# EAGLE design Encoder pHAT (EAGLE 9.6.2)
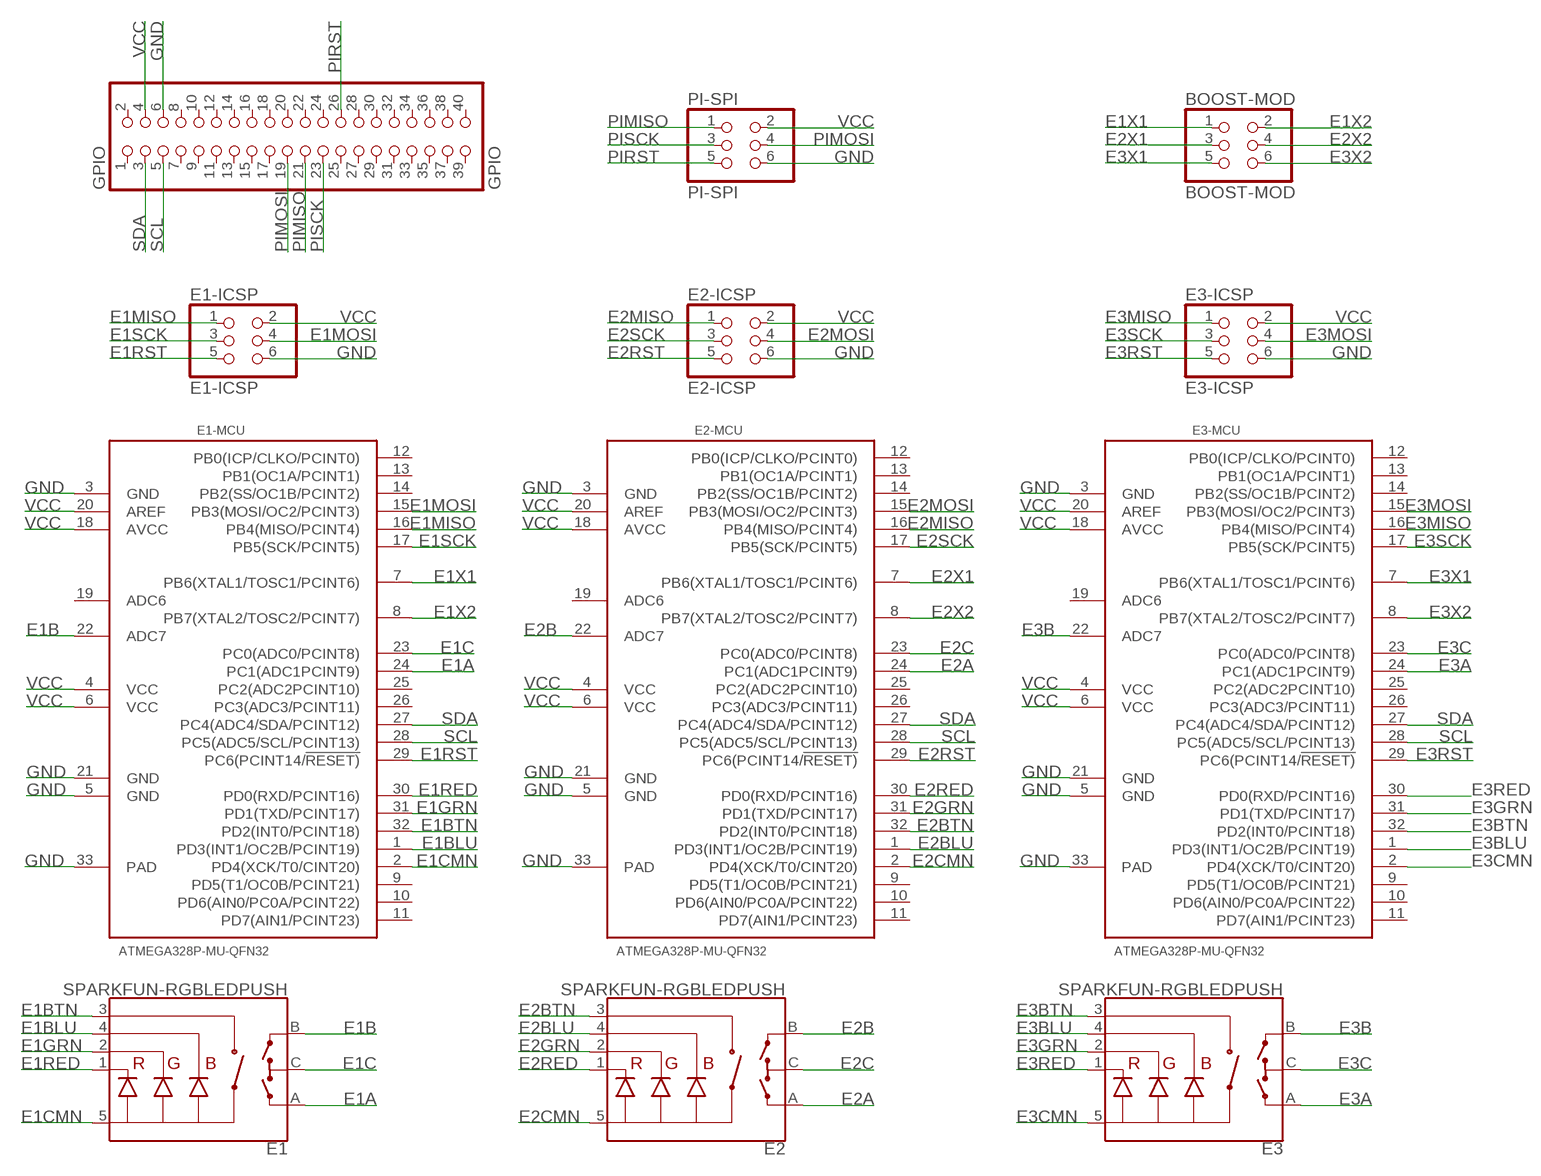
[diagram p0: schematic, sheet 1]

## Parts
BOOST-MOD  BOOST-MOD  PINHD-2X3  [2X03]
E1  SPARKFUN-RGBLEDPUSH  ENCODER-RGB-SWITCH  [ENCODER_LED_3]
E1-ICSP  E1-ICSP  PINHD-2X3  [2X03]
E1-MCU  ATMEGA328P-MU-QFN32  MCU-ATMEGA328P-MU(QFN32)  [QFN32G-0.5-5X5MM]
E2  SPARKFUN-RGBLEDPUSH  ENCODER-RGB-SWITCH  [ENCODER_LED_3]
E2-ICSP  E2-ICSP  PINHD-2X3  [2X03]
E2-MCU  ATMEGA328P-MU-QFN32  MCU-ATMEGA328P-MU(QFN32)  [QFN32G-0.5-5X5MM]
E3  SPARKFUN-RGBLEDPUSH  ENCODER-RGB-SWITCH  [ENCODER_LED_3]
E3-ICSP  E3-ICSP  PINHD-2X3  [2X03]
E3-MCU  ATMEGA328P-MU-QFN32  MCU-ATMEGA328P-MU(QFN32)  [QFN32G-0.5-5X5MM]
GPIO  GPIO  PINHD-2X20  [2X20]
PI-SPI  PI-SPI  PINHD-2X3  [2X03]

## Nets
E1A: E1-MCU.24(PC1(ADC1PCINT9)) E1.A
E1B: E1-MCU.22(ADC7) E1.B
E1BLU: E1-MCU.1(PD3(INT1/OC2B/PCINT19)) E1.4(-B)
E1BTN: E1-MCU.32(PD2(INT0/PCINT18)) E1.3(SW)
E1C: E1-MCU.23(PC0(ADC0/PCINT8)) E1.C
E1CMN: E1-MCU.2(PD4(XCK/T0/CINT20)) E1.5(+)
E1GRN: E1-MCU.31(PD1(TXD/PCINT17)) E1.2(-G)
E1MISO: E1-ICSP.1 E1-MCU.16(PB4(MISO/PCINT4))
E1MOSI: E1-ICSP.4 E1-MCU.15(PB3(MOSI/OC2/PCINT3))
E1RED: E1-MCU.30(PD0(RXD/PCINT16)) E1.1(-R)
E1RST: E1-ICSP.5 E1-MCU.29(PC6(PCINT14/!RESET))
E1SCK: E1-ICSP.3 E1-MCU.17(PB5(SCK/PCINT5))
E1X1: BOOST-MOD.1 E1-MCU.7(PB6(XTAL1/TOSC1/PCINT6))
E1X2: BOOST-MOD.2 E1-MCU.8(PB7(XTAL2/TOSC2/PCINT7))
E2A: E2-MCU.24(PC1(ADC1PCINT9)) E2.A
E2B: E2-MCU.22(ADC7) E2.B
E2BLU: E2-MCU.1(PD3(INT1/OC2B/PCINT19)) E2.4(-B)
E2BTN: E2-MCU.32(PD2(INT0/PCINT18)) E2.3(SW)
E2C: E2-MCU.23(PC0(ADC0/PCINT8)) E2.C
E2CMN: E2-MCU.2(PD4(XCK/T0/CINT20)) E2.5(+)
E2GRN: E2-MCU.31(PD1(TXD/PCINT17)) E2.2(-G)
E2MISO: E2-ICSP.1 E2-MCU.16(PB4(MISO/PCINT4))
E2MOSI: E2-ICSP.4 E2-MCU.15(PB3(MOSI/OC2/PCINT3))
E2RED: E2-MCU.30(PD0(RXD/PCINT16)) E2.1(-R)
E2RST: E2-ICSP.5 E2-MCU.29(PC6(PCINT14/!RESET))
E2SCK: E2-ICSP.3 E2-MCU.17(PB5(SCK/PCINT5))
E2X1: BOOST-MOD.3 E2-MCU.7(PB6(XTAL1/TOSC1/PCINT6))
E2X2: BOOST-MOD.4 E2-MCU.8(PB7(XTAL2/TOSC2/PCINT7))
E3A: E3-MCU.24(PC1(ADC1PCINT9)) E3.A
E3B: E3-MCU.22(ADC7) E3.B
E3BLU: E3-MCU.1(PD3(INT1/OC2B/PCINT19)) E3.4(-B)
E3BTN: E3-MCU.32(PD2(INT0/PCINT18)) E3.3(SW)
E3C: E3-MCU.23(PC0(ADC0/PCINT8)) E3.C
E3CMN: E3-MCU.2(PD4(XCK/T0/CINT20)) E3.5(+)
E3GRN: E3-MCU.31(PD1(TXD/PCINT17)) E3.2(-G)
E3MISO: E3-ICSP.1 E3-MCU.16(PB4(MISO/PCINT4))
E3MOSI: E3-ICSP.4 E3-MCU.15(PB3(MOSI/OC2/PCINT3))
E3RED: E3-MCU.30(PD0(RXD/PCINT16)) E3.1(-R)
E3RST: E3-ICSP.5 E3-MCU.29(PC6(PCINT14/!RESET))
E3SCK: E3-ICSP.3 E3-MCU.17(PB5(SCK/PCINT5))
E3X1: BOOST-MOD.5 E3-MCU.7(PB6(XTAL1/TOSC1/PCINT6))
E3X2: BOOST-MOD.6 E3-MCU.8(PB7(XTAL2/TOSC2/PCINT7))
GND: E1-ICSP.6 E1-MCU.3(GND) E1-MCU.5(GND) E1-MCU.21(GND) E1-MCU.33(PAD) E2-ICSP.6 E2-MCU.3(GND) E2-MCU.5(GND) E2-MCU.21(GND) E2-MCU.33(PAD) E3-ICSP.6 E3-MCU.3(GND) E3-MCU.5(GND) E3-MCU.21(GND) E3-MCU.33(PAD) GPIO.6 PI-SPI.6
PIMISO: GPIO.21 PI-SPI.1
PIMOSI: GPIO.19 PI-SPI.4
PIRST: GPIO.26 PI-SPI.5
PISCK: GPIO.23 PI-SPI.3
SCL: E1-MCU.28(PC5(ADC5/SCL/PCINT13)) E2-MCU.28(PC5(ADC5/SCL/PCINT13)) E3-MCU.28(PC5(ADC5/SCL/PCINT13)) GPIO.5
SDA: E1-MCU.27(PC4(ADC4/SDA/PCINT12)) E2-MCU.27(PC4(ADC4/SDA/PCINT12)) E3-MCU.27(PC4(ADC4/SDA/PCINT12)) GPIO.3
VCC: E1-ICSP.2 E1-MCU.4(VCC) E1-MCU.6(VCC) E1-MCU.18(AVCC) E1-MCU.20(AREF) E2-ICSP.2 E2-MCU.4(VCC) E2-MCU.6(VCC) E2-MCU.18(AVCC) E2-MCU.20(AREF) E3-ICSP.2 E3-MCU.4(VCC) E3-MCU.6(VCC) E3-MCU.18(AVCC) E3-MCU.20(AREF) GPIO.4 PI-SPI.2
Unconnected: E1-MCU.9(PD5(T1/OC0B/PCINT21)) E1-MCU.10(PD6(AIN0/PC0A/PCINT22)) E1-MCU.11(PD7(AIN1/PCINT23)) E1-MCU.12(PB0(ICP/CLKO/PCINT0)) E1-MCU.13(PB1(OC1A/PCINT1)) E1-MCU.14(PB2(SS/OC1B/PCINT2)) E1-MCU.19(ADC6) E1-MCU.25(PC2(ADC2PCINT10)) E1-MCU.26(PC3(ADC3/PCINT11)) E2-MCU.9(PD5(T1/OC0B/PCINT21)) E2-MCU.10(PD6(AIN0/PC0A/PCINT22)) E2-MCU.11(PD7(AIN1/PCINT23)) E2-MCU.12(PB0(ICP/CLKO/PCINT0)) E2-MCU.13(PB1(OC1A/PCINT1)) E2-MCU.14(PB2(SS/OC1B/PCINT2)) E2-MCU.19(ADC6) E2-MCU.25(PC2(ADC2PCINT10)) E2-MCU.26(PC3(ADC3/PCINT11)) E3-MCU.9(PD5(T1/OC0B/PCINT21)) E3-MCU.10(PD6(AIN0/PC0A/PCINT22)) E3-MCU.11(PD7(AIN1/PCINT23)) E3-MCU.12(PB0(ICP/CLKO/PCINT0)) E3-MCU.13(PB1(OC1A/PCINT1)) E3-MCU.14(PB2(SS/OC1B/PCINT2)) E3-MCU.19(ADC6) E3-MCU.25(PC2(ADC2PCINT10)) E3-MCU.26(PC3(ADC3/PCINT11)) GPIO.1 GPIO.2 GPIO.7 GPIO.8 GPIO.9 GPIO.10 GPIO.11 GPIO.12 GPIO.13 GPIO.14 GPIO.15 GPIO.16 GPIO.17 GPIO.18 GPIO.20 GPIO.22 GPIO.24 GPIO.25 GPIO.27 GPIO.28 GPIO.29 GPIO.30 GPIO.31 GPIO.32 GPIO.33 GPIO.34 GPIO.35 GPIO.36 GPIO.37 GPIO.38 GPIO.39 GPIO.40

## Library data of the parts
BOOST-MOD E1-ICSP E2-ICSP E3-ICSP PI-SPI = pinhead:PINHD-2X3: PIN HEADER
E1-E3 = SparkFun-Switches:ENCODER-RGB-SWITCH: Illuminated Rotary Encoder w/ RGB LED and select switch Encoders rotate similarly to potentiometers, but they’re different from potentiometers in that an encoder has full rotation without limits. They output gray code so that you can tell how much and in which direction the encoder has been turned. This encoder includes an RGB LED and a push-down select switch. Part #: Top Up EC12PLRGBSDVBF-D <http://top-up.so-buy.com/front/bin/ptdetail.phtml?Part=EC12PLRGBSDVBF-D> SparkFun Products Rotary Encoder - Illuminated (RGB) <https://www.sparkfun.com/products/10982> (COM-10982); PROD_ID: RES-10859; SF_SKU: COM-10982
E1-MCU E2-MCU E3-MCU = OPL_IC:MCU-ATMEGA328P-MU(QFN32): 310010005; MPN: ATMEGA328P-MU
GPIO = pinhead:PINHD-2X20: PIN HEADER

## Board
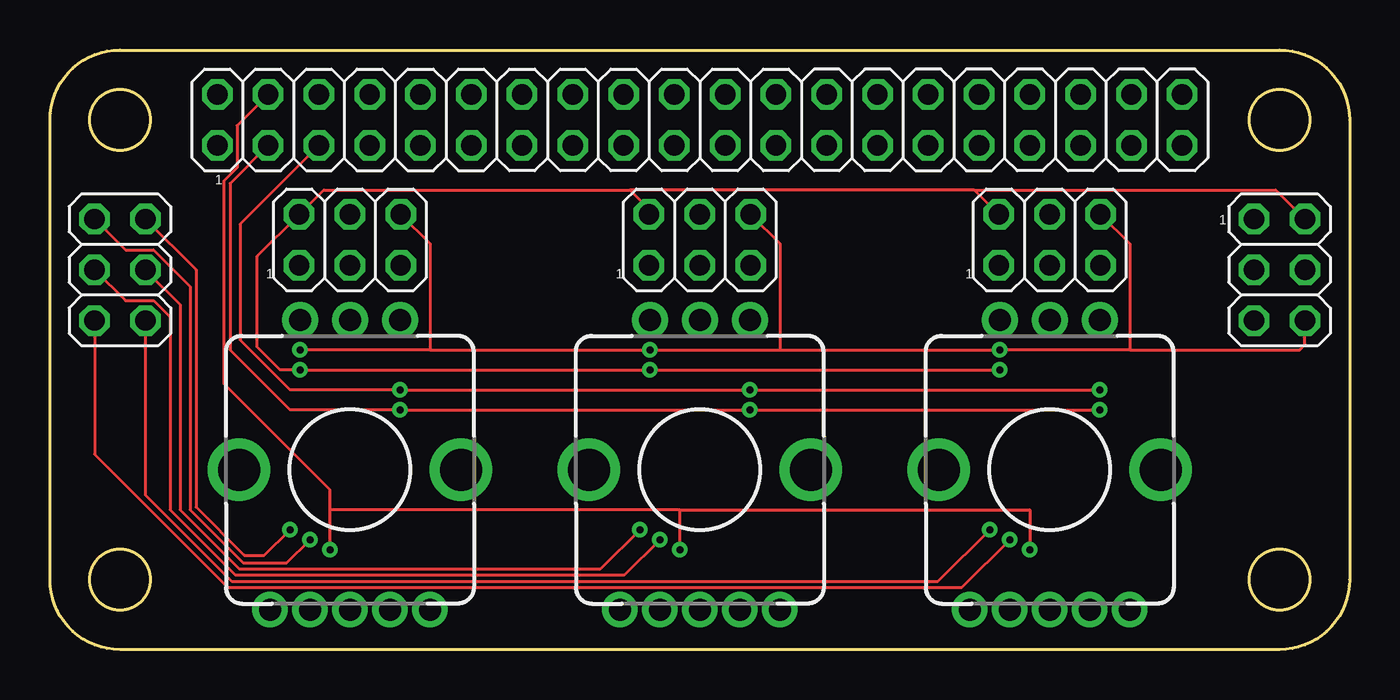
[diagram p1: board, top side]
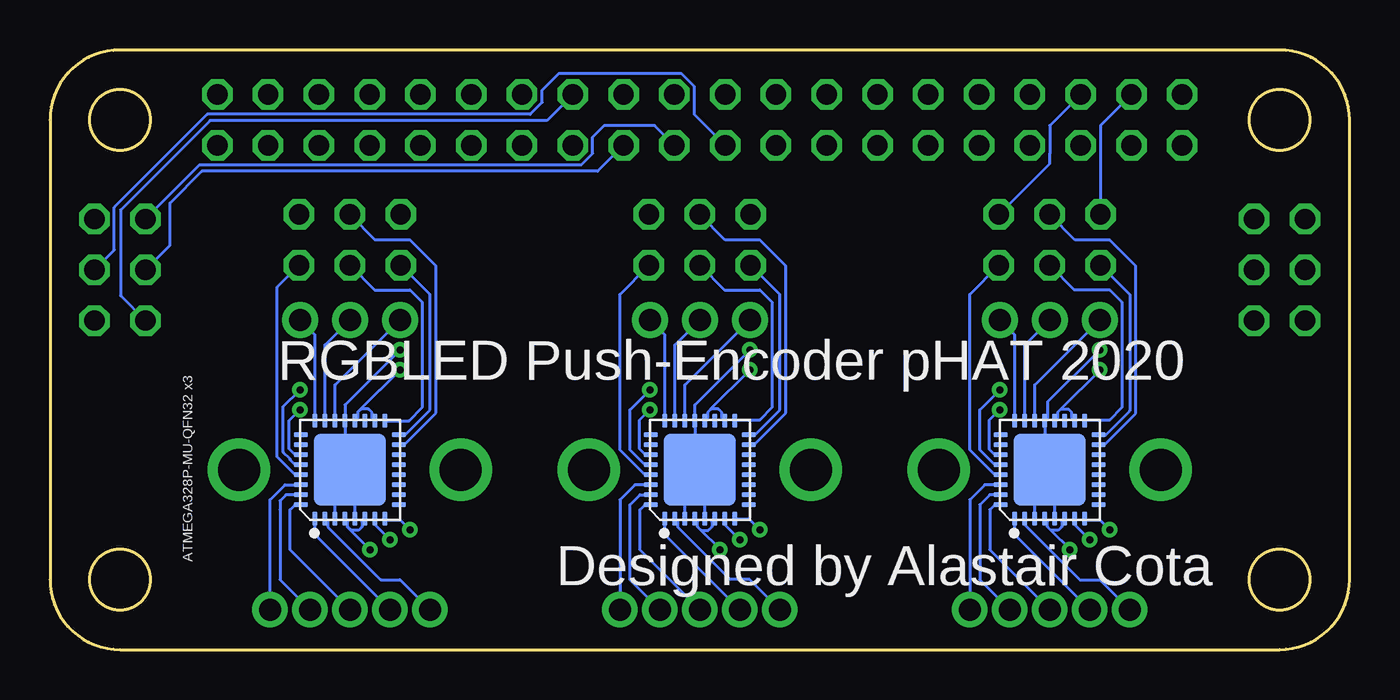
[diagram p2: board, bottom side, seen from below]

Size 65 x 30 mm. Coordinates in mm from the lower left corner, seen from the top.
Outline: 0,3.5 0,26.5 arc-90 3.5,30 61.5,30 arc-90 65,26.5 65,3.5 arc-90 61.5,0 3.5,0 arc-90 0,3.5
Outline: circle at 3.5,3.5 radius 1.5
Outline: circle at 3.5,26.5 radius 1.5
Outline: circle at 61.5,26.5 radius 1.5
Outline: circle at 61.5,3.5 radius 1.5
Copper layers (1*16): Top 0.035mm / dielectric 1.5mm / Bottom 0.035mm
Design rules "default": minimum track width 6mil, minimum drill 0.35mm, track to track 6mil, track to pad 6mil, pad to pad 6mil, via to via 6mil, smd to smd 6mil, copper to edge 40mil, drill to drill 6mil, minimum pad ring 10mil, minimum via ring 8mil, stop-mask expansion 4mil, vias tented up to drill 0mil, thermal gap 10mil

### Footprints (pad centres in the part's own frame; a part is rotated, then mirrored left to right if it is on the bottom)
2X03 = drill 1.016 octagon: 1 -2.54,-1.27; 2 -2.54,1.27; 3 0,-1.27; 4 0,1.27; 5 2.54,-1.27; 6 2.54,1.27
ENCODER_LED_3 = drill 1.1 pad 1.778: 1 -4,7; 2 -2,7; 3 0,7; 4 2,7; 5 4,7 | drill 1.1 pad 1.8: A -2.5,-7.5; B 2.5,-7.5; C 0,-7.5 | drill 2.1: M1 -5.55,0; M2 5.55,0
QFN32G-0.5-5X5MM = smd 0.7 x 0.25: 1 -2.45,1.75; 2 -2.45,1.25; 3 -2.45,0.75; 4 -2.45,0.25; 5 -2.45,-0.25; 6 -2.45,-0.75; 7 -2.45,-1.25; 8 -2.45,-1.75; 17 2.45,-1.75; 18 2.45,-1.25; 19 2.45,-0.75; 20 2.45,-0.25; 21 2.45,0.25; 22 2.45,0.75; 23 2.45,1.25; 24 2.45,1.75 | smd 0.25 x 0.7: 9 -1.75,-2.45; 10 -1.25,-2.45; 11 -0.75,-2.45; 12 -0.25,-2.45; 13 0.25,-2.45; 14 0.75,-2.45; 15 1.25,-2.45; 16 1.75,-2.45; 25 1.75,2.45; 26 1.25,2.45; 27 0.75,2.45; 28 0.25,2.45; 29 -0.25,2.45; 30 -0.75,2.45; 31 -1.25,2.45; 32 -1.75,2.45 | smd 3.6 x 3.6: 33 0,0
2X20 = drill 1.016 octagon: 1 -24.13,-1.27; 2 -24.13,1.27; 3 -21.59,-1.27; 4 -21.59,1.27; 5 -19.05,-1.27; 6 -19.05,1.27; 7 -16.51,-1.27; 8 -16.51,1.27; 9 -13.97,-1.27; 10 -13.97,1.27; 11 -11.43,-1.27; 12 -11.43,1.27; 13 -8.89,-1.27; 14 -8.89,1.27; 15 -6.35,-1.27; 16 -6.35,1.27; 17 -3.81,-1.27; 18 -3.81,1.27; 19 -1.27,-1.27; 20 -1.27,1.27; 21 1.27,-1.27; 22 1.27,1.27; 23 3.81,-1.27; 24 3.81,1.27; 25 6.35,-1.27; 26 6.35,1.27; 27 8.89,-1.27; 28 8.89,1.27; 29 11.43,-1.27; 30 11.43,1.27; 31 13.97,-1.27; 32 13.97,1.27; 33 16.51,-1.27; 34 16.51,1.27; 35 19.05,-1.27; 36 19.05,1.27; 37 21.59,-1.27; 38 21.59,1.27; 39 24.13,-1.27; 40 24.13,1.27

### Placement (x,y rotation side)
BOOST-MOD  3.5,19 270 top
E1  15,9 180 top
E1-ICSP  15,20.5 0 top
E1-MCU  15,9 90 bottom
E2  32.5,9 180 top
E2-ICSP  32.5,20.5 0 top
E2-MCU  32.5,9 90 bottom
E3  50,9 180 top
E3-ICSP  50,20.5 0 top
E3-MCU  50,9 90 bottom
GPIO  32.5,26.5 0 top
PI-SPI  61.5,19 270 top

### Tracks (layer width: path | path; a pad name or v marks a point on that pad's centre or on a via)
E1A
  Bottom 0.152: E1-MCU.24 16.75,15.75 E1.A
E1B
  Bottom 0.152: E1-MCU.22 15.75,13.25 E1.B
E1BLU
  Bottom 0.152: 16.75,6.25 E1-MCU.1 16.75,5.75 E1.4
E1BTN
  Bottom 0.152: E1-MCU.32 17.75,7.25 18,7 18,5 E1.3
E1C
  Bottom 0.152: E1-MCU.23 16.25,15.25 E1.C
E1CMN
  Bottom 0.152: E1.5 12.5,3.5 13.5,3.5 14,4 16.25,6.25 E1-MCU.2
E1GRN
  Bottom 0.152: E1-MCU.31 18,7.75 18.5,7.25 18.5,3.5 E1.2
E1MISO
  Bottom 0.152: E1-MCU.16 12.19,10.75 11,11.94 11,17.77 E1-ICSP.1
E1MOSI
  Bottom 0.152: E1-ICSP.4 13.73,20.5 12,20.5 10.7,19.2 10.7,11.81 12.26,10.25 E1-MCU.15
E1RED
  Bottom 0.152: E1-MCU.30 18.25,8.25 19,7.5 E1.1
E1RST
  Bottom 0.152: E1-MCU.29 17.75,8.75 19,10 19,17.77 E1-ICSP.5
E1SCK
  Bottom 0.152: E1-MCU.17 13.2,11.5 12,11.5 11.37,12.13 11.37,17.37 12,18 13.77,18 E1-ICSP.3
E1X1  (via drill 0.35)
  Top 0.152: BOOST-MOD.1 3.78,19.99 5.18,19.99 7,18.17 7,7 9.66,4.34 10,4.34 10.5,4.34 11.84,4.34 v13,5.5
  Bottom 0.152: E1-MCU.7 13.75,6.25 v13,5.5
E1X2  (via drill 0.35)
  Top 0.152: v12,6 10.72,4.72 9.72,4.72 7.3,7.13 7.3,19 BOOST-MOD.2
  Bottom 0.152: E1-MCU.8 13.2,6.5 12.5,6.5 v12,6
E2A
  Bottom 0.152: E2-MCU.24 34.25,15.75 E2.A
E2B
  Bottom 0.152: E2-MCU.22 33.25,13.25 E2.B
E2BLU
  Bottom 0.152: E2.4 34.25,5.75 E2-MCU.1
E2BTN
  Bottom 0.152: E2.3 35.5,5 35.5,7 35.25,7.25 E2-MCU.32
E2C
  Bottom 0.152: E2-MCU.23 33.75,15.25 E2.C
E2CMN
  Bottom 0.152: E2-MCU.2 33.6,6.4 33.6,6.14 30.98,3.52 30.02,3.52 E2.5
E2GRN
  Bottom 0.152: E2.2 36,3.5 36,6.96 36,7.25 35.5,7.75 35.21,7.75 E2-MCU.31
E2MISO
  Bottom 0.152: E2-ICSP.1 28.5,17.77 28.5,12 29.75,10.75 E2-MCU.16
E2MOSI
  Bottom 0.152: E2-ICSP.4 31.23,20.5 29.5,20.5 28.2,19.2 28.2,11.84 29.79,10.25 E2-MCU.15 29.75,10.25
E2RED
  Bottom 0.152: E2-MCU.30 35.75,8.25 36.5,7.5 E2.1
E2RST
  Bottom 0.152: E2-MCU.29 35.25,8.75 36.5,10 36.5,17.77 E2-ICSP.5
E2SCK
  Bottom 0.152: E2-MCU.17 30.7,11.5 29.5,11.5 28.87,12.13 28.87,17.37 29.5,18 31.27,18 E2-ICSP.3
E2X1  (via drill 0.35)
  Top 0.152: BOOST-MOD.3 3.78,17.45 5.18,17.45 6,16.63 6,7 9.27,3.73 28.73,3.73 v30.5,5.5
  Bottom 0.152: E2-MCU.7 31.25,6.25 v30.5,5.5
E2X2  (via drill 0.35)
  Top 0.152: BOOST-MOD.4 6.5,17.27 6.5,7 9.47,4.03 27.53,4.03 v29.5,6
  Bottom 0.152: E2-MCU.8 30.05,6.55 v29.5,6
E3A
  Bottom 0.152: E3-MCU.24 51.75,15.75 E3.A
E3B
  Bottom 0.152: E3-MCU.22 50.75,13.25 E3.B
E3BLU
  Bottom 0.152: E3.4 51.75,5.75 E3-MCU.1
E3BTN
  Bottom 0.152: E3.3 53,5 53,7 52.75,7.25 E3-MCU.32
E3C
  Bottom 0.152: E3-MCU.23 51.25,15.25 E3.C
E3CMN
  Bottom 0.152: E3.5 47.5,3.5 48.46,3.5 51.1,6.14 51.1,6.4 E3-MCU.2
E3GRN
  Bottom 0.152: E3.2 53.5,3.5 53.5,7 53.5,7.45 53.2,7.75 53,7.75 | E3-MCU.31 53,7.75 | 53,7.75
E3MISO
  Bottom 0.152: E3-ICSP.1 46,17.77 46,12 47.25,10.75 E3-MCU.16
E3MOSI
  Bottom 0.152: E3-ICSP.4 48.73,20.5 47,20.5 45.7,19.2 45.7,11.84 47.29,10.25 E3-MCU.15
E3RED
  Bottom 0.152: E3.1 54,7.5 53.25,8.25 E3-MCU.30
E3RST
  Bottom 0.152: E3-MCU.29 52.75,8.75 53.64,9.64 53.64,18.13 E3-ICSP.5
E3SCK
  Bottom 0.152: E3-ICSP.3 48.77,18 47,18 46.37,17.37 46.37,12.13 47.05,11.45 E3-MCU.17
E3X1  (via drill 0.35)
  Top 0.152: BOOST-MOD.5 2.23,9.77 8.88,3.12 45.62,3.12 v48,5.5
  Bottom 0.152: E3-MCU.7 48.75,6.25 v48,5.5
E3X2  (via drill 0.35)
  Top 0.152: BOOST-MOD.6 4.77,7.73 9.08,3.42 44.42,3.42 v47,6
  Bottom 0.152: E3-MCU.8 48.2,6.5 47.5,6.5 v47,6
GND  (via drill 0.35)
  Top 0.152: 19,15 v30,15 36.5,15 | 36.5,15 v47.5,15 54,15 | E1-ICSP.6 19,20.31 19,15 | 19,15 v12.5,15 | E3-ICSP.6 54,20.31 54,15 | E2-ICSP.6 36.5,20.31 36.5,15 | 54,15 62.5,15 62.77,15.27 PI-SPI.6
  Bottom 0.152: E1-MCU.3 15.75,8.25 E1-MCU.33 | E1-MCU.5 14.75,8.75 E1-MCU.33 | E1-MCU.33 15.25,9.25 E1-MCU.21 15.1,11.6 15.1,12.4 v12.5,15 | E2-MCU.5 32.25,8.75 E2-MCU.33 | E2-MCU.3 33.25,8.25 E2-MCU.33 | E2-MCU.33 32.75,9.25 E2-MCU.21 32.75,12.25 v30,15 | E3-MCU.5 49.75,8.75 E3-MCU.33 | E3-MCU.3 50.75,8.25 E3-MCU.33 | E3-MCU.33 50.25,9.25 E3-MCU.21 50.25,12.25 v47.5,15 | GPIO.6 15,26.22 15,24.82 15,24.31 E1-ICSP.6
PIMISO
  Bottom 0.152: PI-SPI.1 57.53,24.24 38.44,24.24 37.86,24.82 37.86,25.64 37.28,26.22 34.76,26.22 GPIO.21
PIMOSI
  Bottom 0.152: PI-SPI.4 61.78,19.99 61.78,22.13 57.13,26.78 40.98,26.78 40.38,27.38 40.38,28 39.55,28.83 33.43,28.83 32.78,28.18 32.78,26.78 GPIO.19
PIRST
  Bottom 0.152: PI-SPI.5 61.48,17.7 61.48,22 57,26.48 40.15,26.48 GPIO.26
PISCK
  Bottom 0.152: PI-SPI.3 59,20.23 59,22.34 57.4,23.93 37.6,23.93 GPIO.23
SCL  (via drill 0.35)
  Top 0.152: v52.5,13 v35,13 v17.5,13 12,13 9.5,15.5 9.5,21.28 GPIO.5
  Bottom 0.152: E1-MCU.28 17.75,9.25 18.5,10 18.5,12 v17.5,13 | E2-MCU.28 35.25,9.25 36,10 36,12 v35,13 | E3-MCU.28 52.75,9.25 53,9.5 53,9.54 53.33,9.87 53.33,12.17 v52.5,13
SDA  (via drill 0.35)
  Top 0.152: v52.5,12 v35,12 v17.5,12 12,12 9,15 9,23.32 GPIO.3
  Bottom 0.152: E1-MCU.27 17.75,9.75 18.03,10.03 18.03,11.47 v17.5,12 | v35,12 35.53,11.47 35.53,10.07 35.21,9.75 E2-MCU.27 | E3-MCU.27 52.75,9.75 53.03,10.03 53.03,11.47 v52.5,12
VCC  (via drill 0.35)
  Top 0.152: v14,5 14,7 | v31.5,5 31.5,7 | 31.5,7 49,7 v49,5 | 31.5,7 14,7 | v47.5,14 v30,14 v12.5,14 11.5,14 10.37,15.13 10.37,19.68 E1-ICSP.2 13.69,23 29,23 | 14,7 14,8 8.7,13.3 8.7,23.45 9.36,24.11 9.36,26.22 GPIO.4 | 29,23 29.96,22.04 E2-ICSP.2 | E3-ICSP.2 46.23,23 | 46.23,23 29,23 | 46.23,23 61.31,23 PI-SPI.2
  Bottom 0.152: 31.93,12.03 31.57,12.03 31.4,11.86 31.4,11.6 E2-MCU.18 | 31.93,12.03 32.1,11.86 32.1,11.6 E2-MCU.20 | 14.43,12.03 14.07,12.03 13.9,11.86 13.9,11.6 E1-MCU.18 | 14.43,12.03 14.6,11.86 14.6,11.6 E1-MCU.20 | 49.43,12.03 49.07,12.03 48.9,11.86 48.9,11.6 E3-MCU.18 | 49.43,12.03 49.6,11.86 | 49.6,11.86 49.6,11.6 E3-MCU.20 | 49.98,6.02 49.93,5.97 49.57,5.97 49.4,6.14 49.4,6.4 E3-MCU.6 | 49.98,6.02 50.1,6.14 | 50.1,6.14 50.1,6.4 E3-MCU.4 | 32.43,5.97 32.07,5.97 31.9,6.14 31.9,6.4 E2-MCU.6 | 32.43,5.97 32.6,6.14 32.6,6.4 E2-MCU.4 | 14.93,5.97 14.57,5.97 14.4,6.14 14.4,6.4 E1-MCU.6 | E1-MCU.4 15.1,6.4 15.1,6.14 14.93,5.97 | v12.5,14 12.5,13.96 14.43,12.03 | E1-ICSP.2 12.46,24.82 12.46,26.22 GPIO.4 | 14.93,5.97 14,5.04 v14,5 | v31.5,5 31.5,5.04 32.43,5.97 | 49.98,5.98 49.98,6.02 | 49.98,5.98 50.1,6.1 50.1,6.14 | 49.98,5.98 v49,5 | 31.93,12.03 31.93,12.07 v30,14 | 49.43,12.03 49.43,12.07 v47.5,14 49.6,11.9 49.6,11.86

### Text on the board
tNames: 1 | 1 | 1 | 1 | 1
bNames: RGBLED Push-Encoder pHAT 2020 | ATMEGA328P-MU-QFN32 x3 | Designed by Alastair Cota